# Altium schematic sheet USB_HUB1.SchDoc: USB_HUB 3.0
size A2; DrawnBy: Luca Schenetti; Revision: A; SheetNumber: 4; SheetTotal: 10
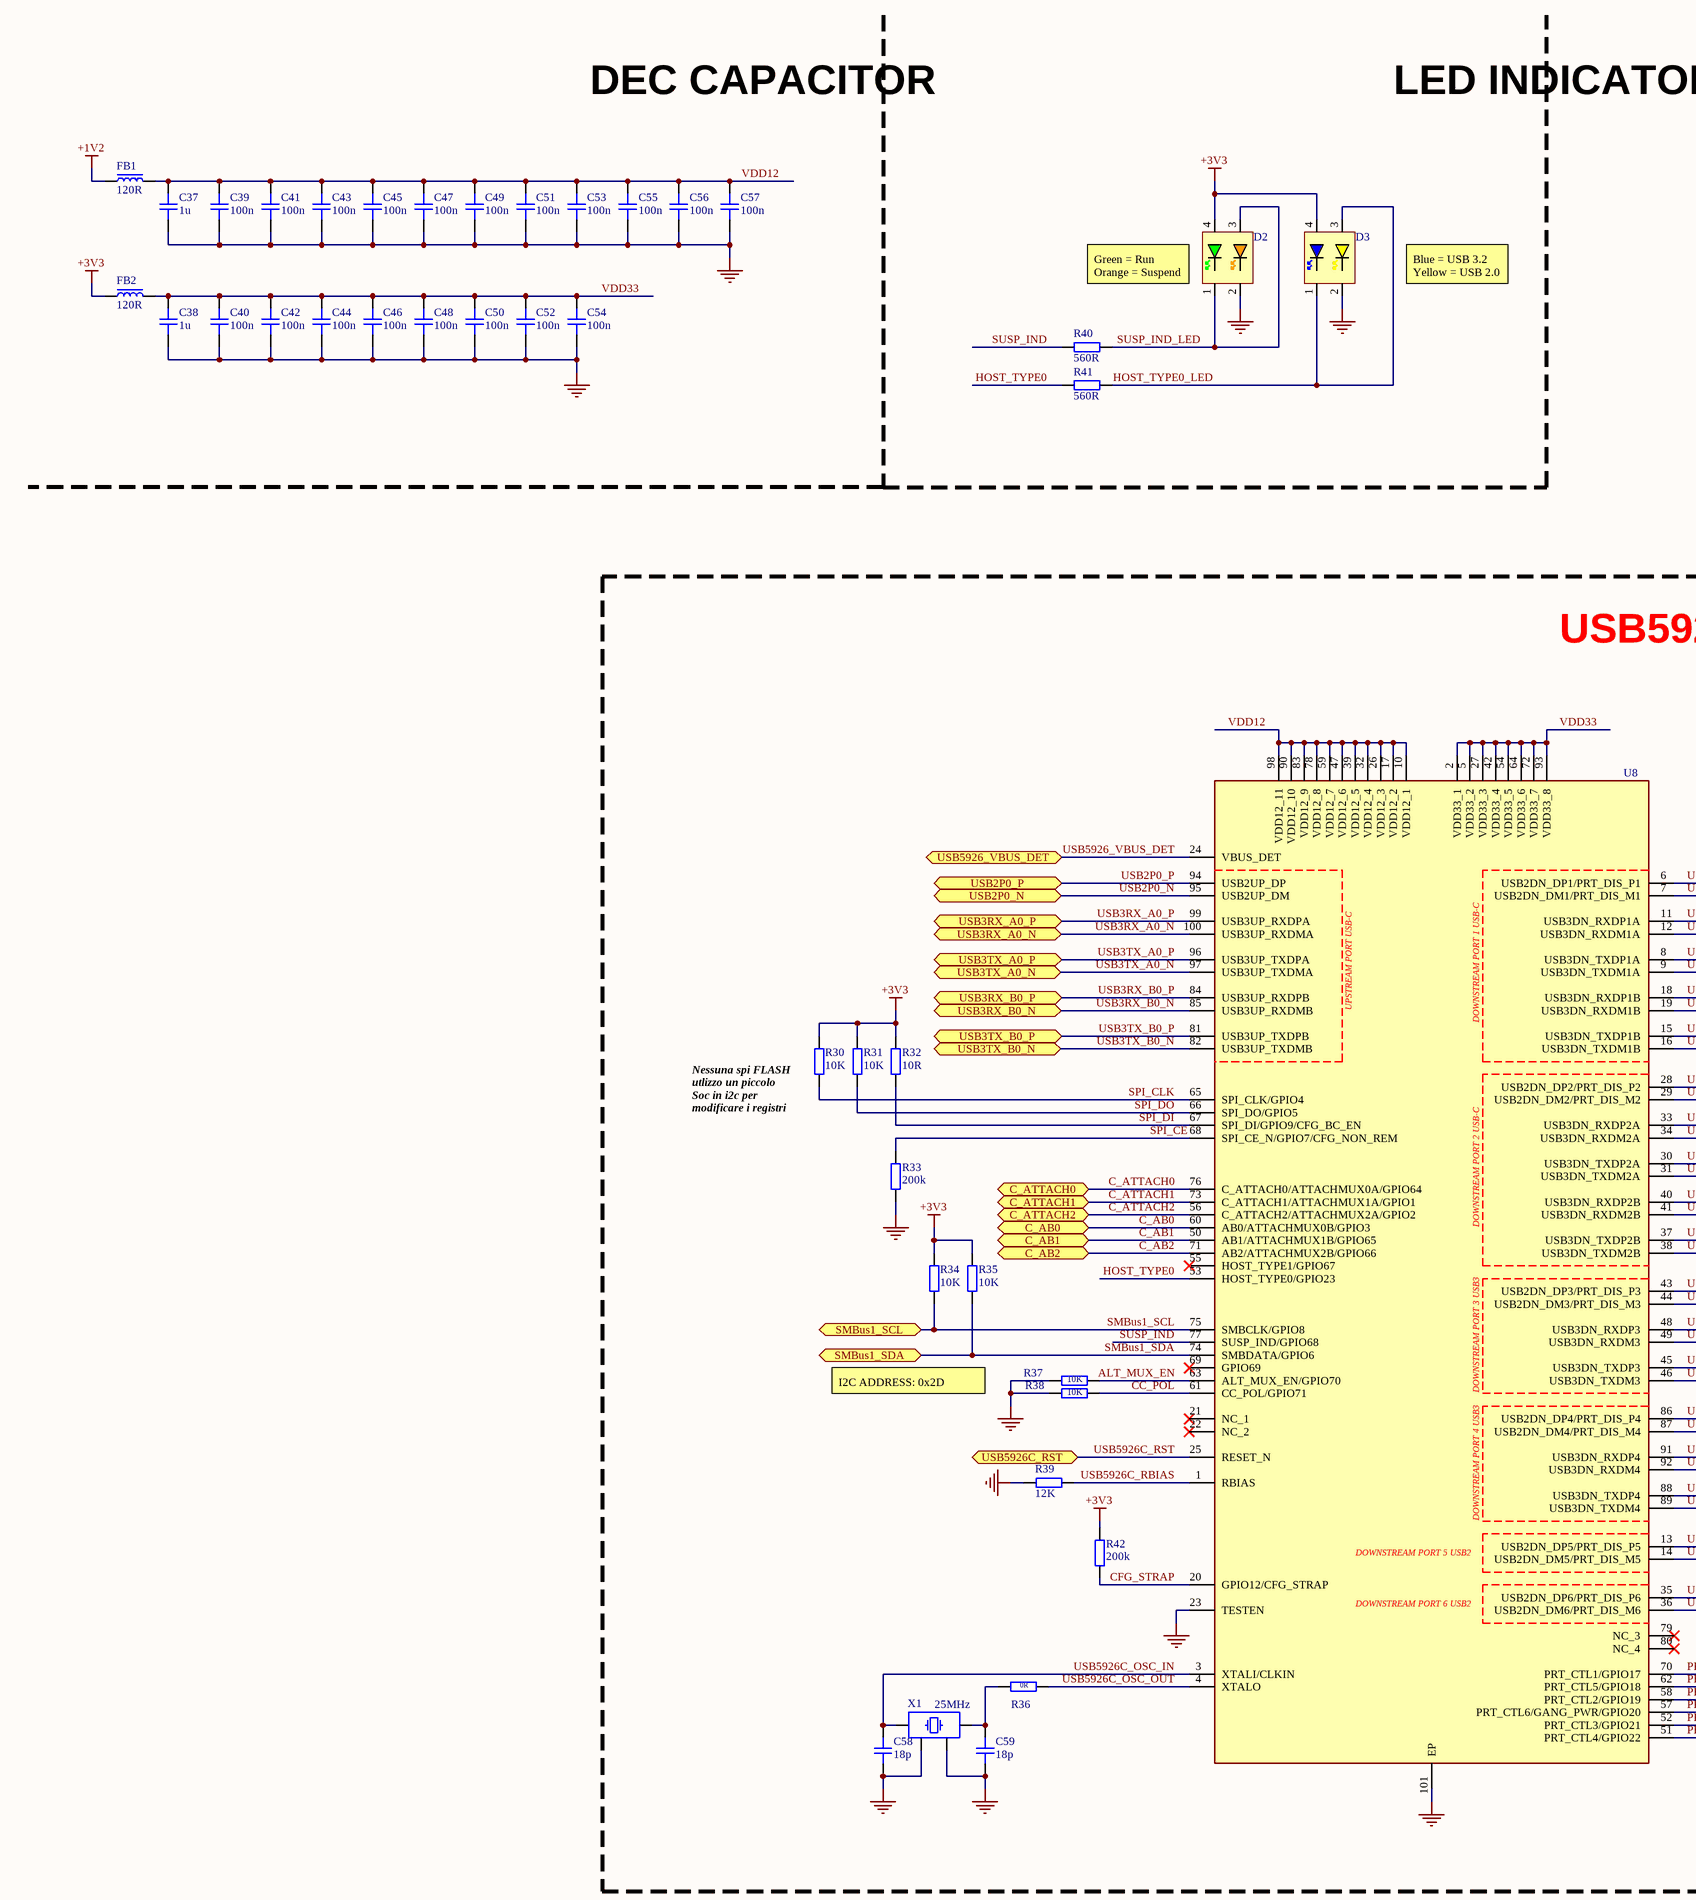
[diagram p0: USB_HUB1.SchDoc, left]
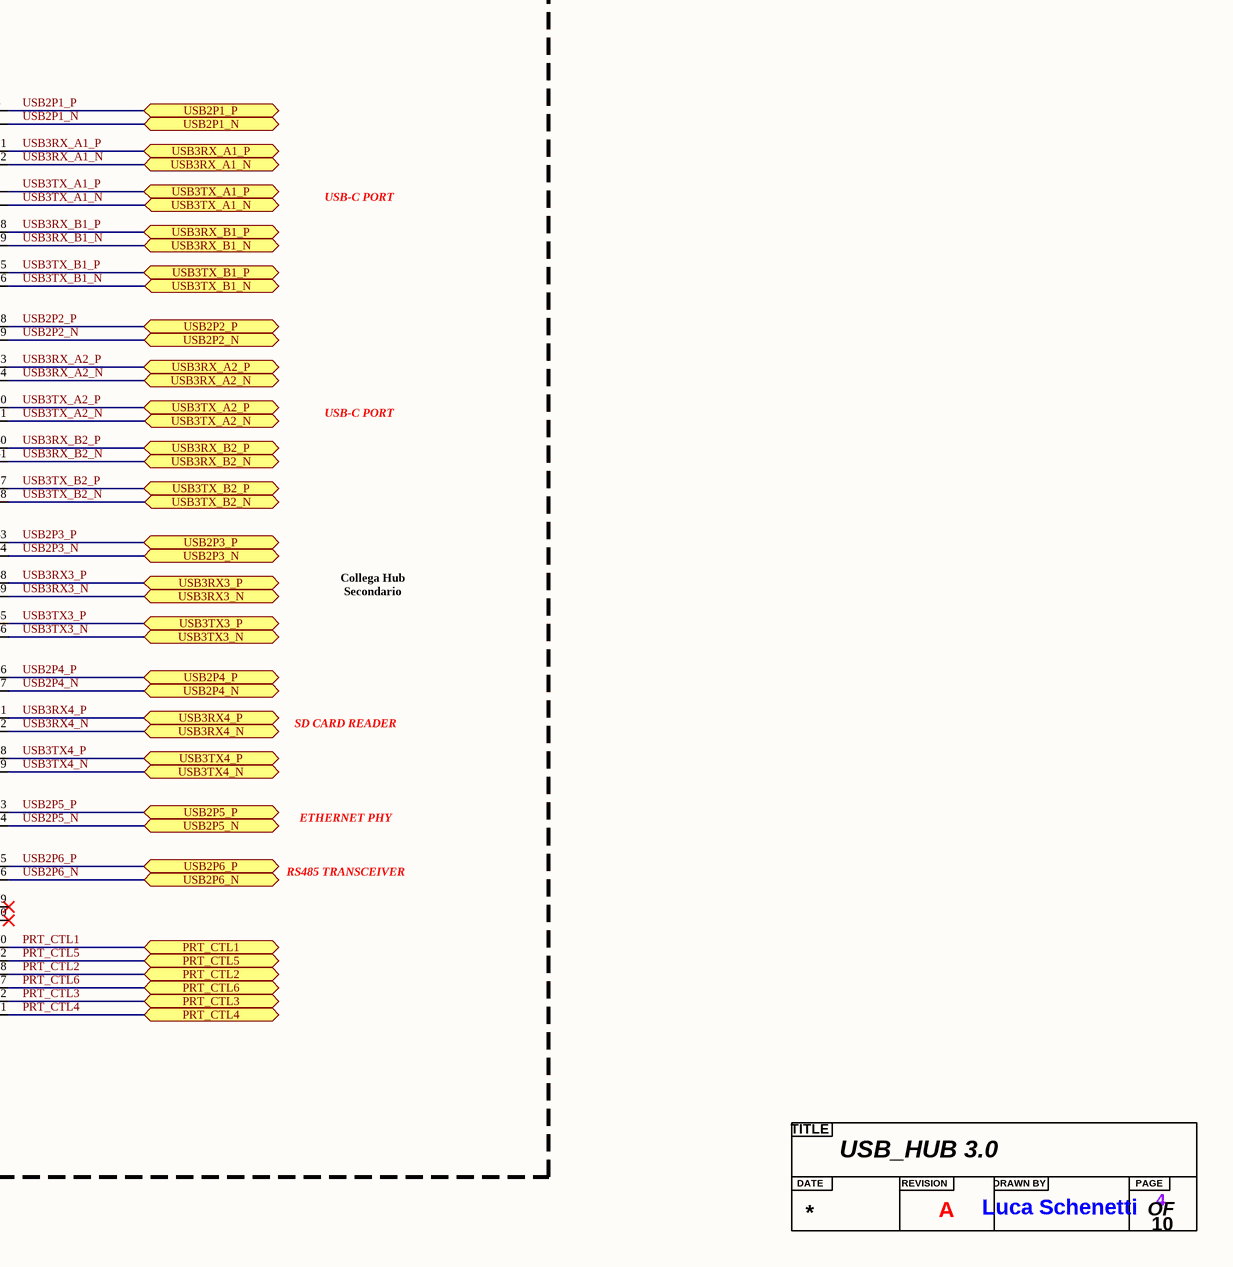
[diagram p1: USB_HUB1.SchDoc, right]

## Parts
?  Title  (value not drawn)  (graphical)
C37  1u  [CAP_0603]
C38  1u  [CAP_0603]
C39  100n  [CAP_0603]
C40  100n  [CAP_0603]
C41  100n  [CAP_0603]
C42  100n  [CAP_0603]
C43  100n  [CAP_0603]
C44  100n  [CAP_0603]
C45  100n  [CAP_0603]
C46  100n  [CAP_0603]
C47  100n  [CAP_0603]
C48  100n  [CAP_0603]
C49  100n  [CAP_0603]
C50  100n  [CAP_0603]
C51  100n  [CAP_0603]
C52  100n  [CAP_0603]
C53  100n  [CAP_0603]
C54  100n  [CAP_0603]
C55  100n  [CAP_0603]
C56  100n  [CAP_0603]
C57  100n  [CAP_0603]
C58  18p  [CAP_0402]
C59  18p  [CAP_0402]
D2  TWO LED Orange Green 0603  [A-SP1962S1GHC-C01-3T]  (value not drawn)
D3  TWO LED Yellow Blue 0603  [A-SP1962Y3B1C-C01-3T]  (value not drawn)
FB1  120R  [FB_0603]
FB2  120R  [FB_0603]
R30  10K  [RES_0603]
R31  10K  [RES_0603]
R32  10R  [RES_0603]
R33  200k  [RES_0603]
R34  10K  [RES_0603]
R35  10K  [RES_0603]
R36  0R  [RES_0402]
R37  10K  [RES_0603]
R38  10K  [RES_0603]
R39  12K  [RES_0603]
R40  560R  [RES_0603]
R41  560R  [RES_0603]
R42  200k  [RES_0603]
U8  6-Port USB 3.1 Gen 1 Smart Hub  [USB5926C/KD]  (value not drawn)
X1  25MHz  [XTAL_3225]

## Blocks framed on the sheet
USB5926C/KD: C58 C59 R30-R39 R42 U8 X1

## Ports
C_AB0 (bidir, see USB_HUB1 UP PORT0[8B]), C_AB1 (bidir, see USB_HUB1 DN PORT 1_2[7B]), C_AB2 (bidir, see USB_HUB1 DN PORT 1_2[7D]), C_ATTACH0 (bidir, see USB_HUB1 UP PORT0[8B]), C_ATTACH1 (bidir, see USB_HUB1 DN PORT 1_2[7B]), C_ATTACH2 (bidir, see USB_HUB1 DN PORT 1_2[7D]), PRT_CTL1 (bidir, see USB_HUB1 DN PORT 1_2[7B]), PRT_CTL2 (bidir, see USB_HUB1 DN PORT 1_2[7D]), PRT_CTL3 (bidir, see USB_HUB1 DN PORT 3[4A]), PRT_CTL4 (bidir, see USB_HUB1 DN PORT 4[6C]), PRT_CTL5 (bidir, see USB_HUB1 DN PORT 5[1A]), PRT_CTL6 (bidir, see USB_HUB1 DN PORT 6[1A]), SMBus1_SCL (bidir, see MCU[4C]), SMBus1_SDA (bidir, see MCU[4C]), USB2P0_N (bidir, see USB_HUB1 UP PORT0[3B]), USB2P0_P (bidir, see USB_HUB1 UP PORT0[3B]), USB2P1_N (bidir, see USB_HUB1 DN PORT 1_2[2A]), USB2P1_P (bidir, see USB_HUB1 DN PORT 1_2[2A]), USB2P2_N (bidir, see USB_HUB1 DN PORT 1_2[2C]), USB2P2_P (bidir, see USB_HUB1 DN PORT 1_2[2C]), USB2P3_N (bidir, see USB_HUB1 DN PORT 3[1B]), USB2P3_P (bidir, see USB_HUB1 DN PORT 3[1B]), USB2P4_N (bidir, see USB_HUB1 DN PORT 4[2B]), USB2P4_P (bidir, see USB_HUB1 DN PORT 4[2B]), USB2P5_N (bidir, see USB_HUB1 DN PORT 5[3B]), USB2P5_P (bidir, see USB_HUB1 DN PORT 5[3B]), USB2P6_N (bidir, see USB_HUB1 DN PORT 6[1B]), USB2P6_P (bidir, see USB_HUB1 DN PORT 6[1B]), USB3RX3_N (bidir, see USB_HUB1 DN PORT 3[1C]), USB3RX3_P (bidir, see USB_HUB1 DN PORT 3[1C]), USB3RX4_N (bidir, see USB_HUB1 DN PORT 4[1B]), USB3RX4_P (bidir, see USB_HUB1 DN PORT 4[1B]), USB3RX_A0_N (bidir, see USB_HUB1 UP PORT0[3B]), USB3RX_A0_P (bidir, see USB_HUB1 UP PORT0[3B]), USB3RX_A1_N (bidir, see USB_HUB1 DN PORT 1_2[2A]), USB3RX_A1_P (bidir, see USB_HUB1 DN PORT 1_2[2A]), USB3RX_A2_N (bidir, see USB_HUB1 DN PORT 1_2[2C]), USB3RX_A2_P (bidir, see USB_HUB1 DN PORT 1_2[2C]), USB3RX_B0_N (bidir, see USB_HUB1 UP PORT0[3B]), USB3RX_B0_P (bidir, see USB_HUB1 UP PORT0[3B]), USB3RX_B1_N (bidir, see USB_HUB1 DN PORT 1_2[2A]), USB3RX_B1_P (bidir, see USB_HUB1 DN PORT 1_2[2A]), USB3RX_B2_N (bidir, see USB_HUB1 DN PORT 1_2[2C]), USB3RX_B2_P (bidir, see USB_HUB1 DN PORT 1_2[2C]), USB3TX3_N (bidir, see USB_HUB1 DN PORT 3[1B]), USB3TX3_P (bidir, see USB_HUB1 DN PORT 3[1B]), USB3TX4_N (bidir, see USB_HUB1 DN PORT 4[1B]), USB3TX4_P (bidir, see USB_HUB1 DN PORT 4[1B]), USB3TX_A0_N (bidir, see USB_HUB1 UP PORT0[3B]), USB3TX_A0_P (bidir, see USB_HUB1 UP PORT0[3B]), USB3TX_A1_N (bidir, see USB_HUB1 DN PORT 1_2[3A]), USB3TX_A1_P (bidir, see USB_HUB1 DN PORT 1_2[3A]), USB3TX_A2_N (bidir, see USB_HUB1 DN PORT 1_2[3C]), USB3TX_A2_P (bidir, see USB_HUB1 DN PORT 1_2[3C]), USB3TX_B0_N (bidir, see USB_HUB1 UP PORT0[3B]), USB3TX_B0_P (bidir, see USB_HUB1 UP PORT0[3B]), USB3TX_B1_N (bidir, see USB_HUB1 DN PORT 1_2[3A]), USB3TX_B1_P (bidir, see USB_HUB1 DN PORT 1_2[3A]), USB3TX_B2_N (bidir, see USB_HUB1 DN PORT 1_2[3C]), USB3TX_B2_P (bidir, see USB_HUB1 DN PORT 1_2[3C]), USB5926_VBUS_DET (bidir, see USB_HUB1 UP PORT0[4A]), USB5926C_RST (bidir, see MCU[8C], USB_HUB1 DN PORT 1_2[5B], USB_HUB1 DN PORT 1_2[5D], USB_HUB1 DN PORT 5[3D], USB_HUB1 DN PORT 6[1C], USB_HUB1 UP PORT0[5C])

## Nets
+1V2: FB1.1
+3V3: D2.4 D3.4 FB2.1 R30.2 R31.2 R32.2 R34.2 R35.2 R42.2
GND: C37.1 C38.1 C39.1 C40.1 C41.1 C42.1 C43.1 C44.1 C45.1 C46.1 C47.1 C48.1 C49.1 C50.1 C51.1 C52.1 C53.1 C54.1 C55.1 C56.1 C57.1 C58.1 C59.1 D2.2 D3.2 R33.1 R37.2 R38.2 R39.1 U8.23(TESTEN) U8.101(EP) X1.2 X1.4
ALT_MUX_EN: R37.1 U8.63(ALT_MUX_EN/GPIO70)
C_AB0: U8.60(AB0/ATTACHMUX0B/GPIO3) ; port C_AB0
C_AB1: U8.50(AB1/ATTACHMUX1B/GPIO65) ; port C_AB1
C_AB2: U8.71(AB2/ATTACHMUX2B/GPIO66) ; port C_AB2
C_ATTACH0: U8.76(C_ATTACH0/ATTACHMUX0A/GPIO64) ; port C_ATTACH0
C_ATTACH1: U8.73(C_ATTACH1/ATTACHMUX1A/GPIO1) ; port C_ATTACH1
C_ATTACH2: U8.56(C_ATTACH2/ATTACHMUX2A/GPIO2) ; port C_ATTACH2
CC_POL: R38.1 U8.61(CC_POL/GPIO71)
CFG_STRAP: R42.1 U8.20(GPIO12/CFG_STRAP)
HOST_TYPE0: R41.2 U8.53(HOST_TYPE0/GPIO23)
HOST_TYPE0_LED: D3.1 D3.3 R41.1
PRT_CTL1: U8.70(PRT_CTL1/GPIO17) ; port PRT_CTL1
PRT_CTL2: U8.58(PRT_CTL2/GPIO19) ; port PRT_CTL2
PRT_CTL3: U8.52(PRT_CTL3/GPIO21) ; port PRT_CTL3
PRT_CTL4: U8.51(PRT_CTL4/GPIO22) ; port PRT_CTL4
PRT_CTL5: U8.62(PRT_CTL5/GPIO18) ; port PRT_CTL5
PRT_CTL6: U8.57(PRT_CTL6/GANG_PWR/GPIO20) ; port PRT_CTL6
SMBus1_SCL: R34.1 U8.75(SMBCLK/GPIO8) ; port SMBus1_SCL
SMBus1_SDA: R35.1 U8.74(SMBDATA/GPIO6) ; port SMBus1_SDA
SPI_CE: R33.2 U8.68(SPI_CE_N/GPIO7/CFG_NON_REM)
SPI_CLK: R30.1 U8.65(SPI_CLK/GPIO4)
SPI_DI: R32.1 U8.67(SPI_DI/GPIO9/CFG_BC_EN)
SPI_DO: R31.1 U8.66(SPI_DO/GPIO5)
SUSP_IND: R40.2 U8.77(SUSP_IND/GPIO68)
SUSP_IND_LED: D2.1 D2.3 R40.1
USB2P0_N: U8.95(USB2UP_DM) ; port USB2P0_N
USB2P0_P: U8.94(USB2UP_DP) ; port USB2P0_P
USB2P1_N: U8.7(USB2DN_DM1/PRT_DIS_M1) ; port USB2P1_N
USB2P1_P: U8.6(USB2DN_DP1/PRT_DIS_P1) ; port USB2P1_P
USB2P2_N: U8.29(USB2DN_DM2/PRT_DIS_M2) ; port USB2P2_N
USB2P2_P: U8.28(USB2DN_DP2/PRT_DIS_P2) ; port USB2P2_P
USB2P3_N: U8.44(USB2DN_DM3/PRT_DIS_M3) ; port USB2P3_N
USB2P3_P: U8.43(USB2DN_DP3/PRT_DIS_P3) ; port USB2P3_P
USB2P4_N: U8.87(USB2DN_DM4/PRT_DIS_M4) ; port USB2P4_N
USB2P4_P: U8.86(USB2DN_DP4/PRT_DIS_P4) ; port USB2P4_P
USB2P5_N: U8.14(USB2DN_DM5/PRT_DIS_M5) ; port USB2P5_N
USB2P5_P: U8.13(USB2DN_DP5/PRT_DIS_P5) ; port USB2P5_P
USB2P6_N: U8.36(USB2DN_DM6/PRT_DIS_M6) ; port USB2P6_N
USB2P6_P: U8.35(USB2DN_DP6/PRT_DIS_P6) ; port USB2P6_P
USB3RX3_N: U8.49(USB3DN_RXDM3) ; port USB3RX3_N
USB3RX3_P: U8.48(USB3DN_RXDP3) ; port USB3RX3_P
USB3RX4_N: U8.92(USB3DN_RXDM4) ; port USB3RX4_N
USB3RX4_P: U8.91(USB3DN_RXDP4) ; port USB3RX4_P
USB3RX_A0_N: U8.100(USB3UP_RXDMA) ; port USB3RX_A0_N
USB3RX_A0_P: U8.99(USB3UP_RXDPA) ; port USB3RX_A0_P
USB3RX_A1_N: U8.12(USB3DN_RXDM1A) ; port USB3RX_A1_N
USB3RX_A1_P: U8.11(USB3DN_RXDP1A) ; port USB3RX_A1_P
USB3RX_A2_N: U8.34(USB3DN_RXDM2A) ; port USB3RX_A2_N
USB3RX_A2_P: U8.33(USB3DN_RXDP2A) ; port USB3RX_A2_P
USB3RX_B0_N: U8.85(USB3UP_RXDMB) ; port USB3RX_B0_N
USB3RX_B0_P: U8.84(USB3UP_RXDPB) ; port USB3RX_B0_P
USB3RX_B1_N: U8.19(USB3DN_RXDM1B) ; port USB3RX_B1_N
USB3RX_B1_P: U8.18(USB3DN_RXDP1B) ; port USB3RX_B1_P
USB3RX_B2_N: U8.41(USB3DN_RXDM2B) ; port USB3RX_B2_N
USB3RX_B2_P: U8.40(USB3DN_RXDP2B) ; port USB3RX_B2_P
USB3TX3_N: U8.46(USB3DN_TXDM3) ; port USB3TX3_N
USB3TX3_P: U8.45(USB3DN_TXDP3) ; port USB3TX3_P
USB3TX4_N: U8.89(USB3DN_TXDM4) ; port USB3TX4_N
USB3TX4_P: U8.88(USB3DN_TXDP4) ; port USB3TX4_P
USB3TX_A0_N: U8.97(USB3UP_TXDMA) ; port USB3TX_A0_N
USB3TX_A0_P: U8.96(USB3UP_TXDPA) ; port USB3TX_A0_P
USB3TX_A1_N: U8.9(USB3DN_TXDM1A) ; port USB3TX_A1_N
USB3TX_A1_P: U8.8(USB3DN_TXDP1A) ; port USB3TX_A1_P
USB3TX_A2_N: U8.31(USB3DN_TXDM2A) ; port USB3TX_A2_N
USB3TX_A2_P: U8.30(USB3DN_TXDP2A) ; port USB3TX_A2_P
USB3TX_B0_N: U8.82(USB3UP_TXDMB) ; port USB3TX_B0_N
USB3TX_B0_P: U8.81(USB3UP_TXDPB) ; port USB3TX_B0_P
USB3TX_B1_N: U8.16(USB3DN_TXDM1B) ; port USB3TX_B1_N
USB3TX_B1_P: U8.15(USB3DN_TXDP1B) ; port USB3TX_B1_P
USB3TX_B2_N: U8.38(USB3DN_TXDM2B) ; port USB3TX_B2_N
USB3TX_B2_P: U8.37(USB3DN_TXDP2B) ; port USB3TX_B2_P
USB5926_VBUS_DET: U8.24(VBUS_DET) ; port USB5926_VBUS_DET
USB5926C_OSC_IN: C58.2 U8.3(XTALI/CLKIN) X1.3
USB5926C_OSC_OUT: R36.2 U8.4(XTALO)
USB5926C_RBIAS: R39.2 U8.1(RBIAS)
USB5926C_RST: U8.25(RESET_N) ; port USB5926C_RST
VDD12: C37.2 C39.2 C41.2 C43.2 C45.2 C47.2 C49.2 C51.2 C53.2 C55.2 C56.2 C57.2 FB1.2 U8.10(VDD12_1) U8.17(VDD12_2) U8.26(VDD12_3) U8.32(VDD12_4) U8.39(VDD12_5) U8.47(VDD12_6) U8.59(VDD12_7) U8.78(VDD12_8) U8.83(VDD12_9) U8.90(VDD12_10) U8.98(VDD12_11)
VDD33: C38.2 C40.2 C42.2 C44.2 C46.2 C48.2 C50.2 C52.2 C54.2 FB2.2 U8.2(VDD33_1) U8.5(VDD33_2) U8.27(VDD33_3) U8.42(VDD33_4) U8.54(VDD33_5) U8.64(VDD33_6) U8.72(VDD33_7) U8.93(VDD33_8)
NetC59_2: C59.2 R36.1 X1.1

Not connected (* = marked no-connect by the designer): U8 21(NC_1)* 22(NC_2)* 55(HOST_TYPE1/GPIO67)* 69(GPIO69)* 79(NC_3)* 80(NC_4)*

## Notes on the sheet
- DEC CAPACITOR
- LED INDICATOR
- (near D2) Green = Run
  Orange = Suspend
- Blue = USB 3.2
  Yellow = USB 2.0
- USB-C PORT
- (near R32) Ports 1, 2, 3, 4, 5, 6 DCP enabled
- (near R30) Nessuna spi FLASH utlizzo un piccolo Soc in i2c per modificare i registri
- (near R33) All ports are removable
- I2C ADDRESS: 0x2D
- Collega Hub Secondario
- SD CARD READER
- ETHERNET PHY
- (near R42) CONFIG2 SMBus Slave Mode
- RS485 TRANSCEIVER
- (in symbol Title) TITLE; DATE; REVISION; DRAWN BY; PAGE; OF
- (in symbol USB5926C/KD) UPSTREAM PORT USB-C; DOWNSTREAM PORT 1 USB-C; DOWNSTREAM PORT 2 USB-C; DOWNSTREAM PORT 3 USB3; DOWNSTREAM PORT 4 USB3; DOWNSTREAM PORT 5 USB2; DOWNSTREAM PORT 6 USB2

## Library data of the parts
C37 C38 = CAP_0603: Capacitor SMD 0603 [C15849]; Manufacturer: *; Manufacturer Part Number: *; Distributor Link: *; LCSC: *; Rating: *; Dielectric: *
C39-C57 = CAP_0603: Capacitor SMD 0603 [C14663]; Manufacturer: *; Manufacturer Part Number: *; Distributor Link: *; LCSC: *; Rating: *; Dielectric: *
C58 C59 = CAP_0402: Capacitor SMD 0402 [C1549]; Manufacturer: *; Manufacturer Part Number: *; Distributor Link: *; LCSC: *; Rating: *; Dielectric: *
D2 = A-SP1962S1GHC-C01-3T: [C19171293]
D3 = A-SP1962Y3B1C-C01-3T: [C19171299]
FB1 FB2 = FB_0603: Ferrite Bead SMD 0603[C76892]; Manufacturer: *; Manufacturer Part Number: *; Distributor Link: *; LCSC: *
R30 R31 R34 R35 R37 R38 = RES_0603: Resistor SMD 0603[C25804]; Manufacturer: *; Manufacturer Part Number: *; Distributor Link: *; LCSC: *
R32 = RES_0603: Resistor SMD 0603[C22859]; Manufacturer: *; Manufacturer Part Number: *; Distributor Link: *; LCSC: *
R33 R42 = RES_0603: Resistor SMD 0603[C25811]; Manufacturer: *; Manufacturer Part Number: *; Distributor Link: *; LCSC: *
R36 = RES_0402: Resistor SMD 0402 [C17168]; Manufacturer: *; Manufacturer Part Number: *; Distributor Link: *; LCSC: *
R39 = RES_0603: [C22790]; Manufacturer: *; Manufacturer Part Number: *; Distributor Link: *; LCSC: *
R40 R41 = RES_0603: [C23204]; Manufacturer: *; Manufacturer Part Number: *; Distributor Link: *; LCSC: *
U8 = USB5926C/KD: [C3210694]
X1 = TSX-3225_24.0000MF15X-AC: Crystal SMD 24MHz 10PPM 7pF 3225 [C9006]; Manufacturer: Epson; Manufacturer Part Number: TSX-3225 24.0000MF15X-AC